# EAGLE design LiDAR_Demo_Board_Vert (EAGLE 9.2.2)
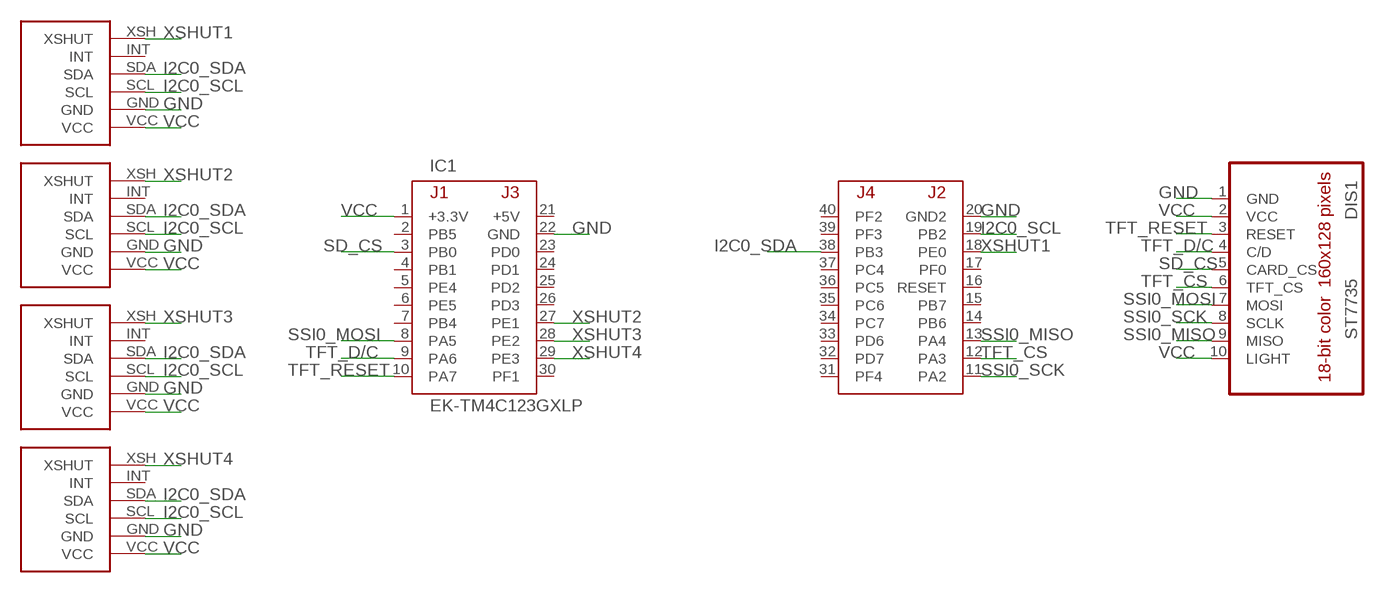
[diagram p0: schematic, sheet 1]

## Parts
DIS1  ST7735  [ST7735]
IC1  EK-TM4C123GXLP  [TM4C123LAUNCHPAD]
U$1  LIDAR_VL53L0X_ATK_VERT  [LIDAR_VL53L0X_ATK_VERT]
U$2  LIDAR_VL53L0X_ATK_VERT  [LIDAR_VL53L0X_ATK_VERT]
U$3  LIDAR_VL53L0X_ATK_VERT  [LIDAR_VL53L0X_ATK_VERT]
U$4  LIDAR_VL53L0X_ATK_VERT  [LIDAR_VL53L0X_ATK_VERT]

## Nets
GND: DIS1.1(GND) IC1.20(GND2) IC1.22(GND) U$1.GND U$2.GND U$3.GND U$4.GND
I2C0_SCL: IC1.19(PB2) U$1.SCL U$2.SCL U$3.SCL U$4.SCL
I2C0_SDA: IC1.38(PB3) U$1.SDA U$2.SDA U$3.SDA U$4.SDA
SD_CS: DIS1.5(CARD_CS) IC1.3(PB0)
SSI0_MISO: DIS1.9(MISO) IC1.13(PA4)
SSI0_MOSI: DIS1.7(MOSI) IC1.8(PA5)
SSI0_SCK: DIS1.8(SCLK) IC1.11(PA2)
TFT_CS: DIS1.6(TFT_CS) IC1.12(PA3)
TFT_D/C: DIS1.4(C/D) IC1.9(PA6)
TFT_RESET: DIS1.3(RESET) IC1.10(PA7)
VCC: DIS1.2(VCC) DIS1.10(LIGHT) IC1.1(+3.3V) U$1.VCC U$2.VCC U$3.VCC U$4.VCC
XSHUT1: IC1.18(PE0) U$1.XSH(XSHUT)
XSHUT2: IC1.27(PE1) U$2.XSH(XSHUT)
XSHUT3: IC1.28(PE2) U$3.XSH(XSHUT)
XSHUT4: IC1.29(PE3) U$4.XSH(XSHUT)
Unconnected: IC1.2(PB5) IC1.4(PB1) IC1.5(PE4) IC1.6(PE5) IC1.7(PB4) IC1.14(PB6) IC1.15(PB7) IC1.16(RESET) IC1.17(PF0) IC1.23(PD0) IC1.24(PD1) IC1.25(PD2) IC1.26(PD3) IC1.30(PF1) IC1.31(PF4) IC1.32(PD7) IC1.33(PD6) IC1.34(PC7) IC1.35(PC6) IC1.36(PC5) IC1.37(PC4) IC1.39(PF3) IC1.40(PF2) U$1.INT U$2.INT U$3.INT U$4.INT

## Power pins joined to a net without a drawn wire
+5V: IC1.21(+5V)

## Library data of the parts
DIS1 = UT_ECE:ST7735: Sitronix ST7735R 18-bit color, 1.8" TFT LCD display, 128*160, http://www.adafruit.com/products/358 // Backlight (pin 10) connected to +3.3 V // MISO (pin 9) PA4 (SSI0Rx) // SCK (pin 8) connected to PA2 (SSI0Clk) // MOSI (pin 7) connected to PA5 (SSI0Tx) // TFT_CS (pin 6) connected to PA3 (SSI0Fss) // CARD_CS (pin 5) connected to PD7 GPIO output(for SDC) // Data/Command (pin 4) connected to PA6 (GPIO), high for data, low for command // RESET (pin 3) connected to PA7 (GPIO) // VCC (pin 2) connected to +3.3 V // Gnd (pin 1) connected to ground; OC_FARNELL: unknown; OC_NEWARK: unknown
IC1 = UT_ECE:EK-TM4C123GXL: Texas Instruments TM4C123 LaunchPad EK-TM4C123GXL www.ti.com/tool/ek-tm4c123gxl
U$1-U$4 = Z:LIDAR_VL53L0X_ATK_VERT

## Board
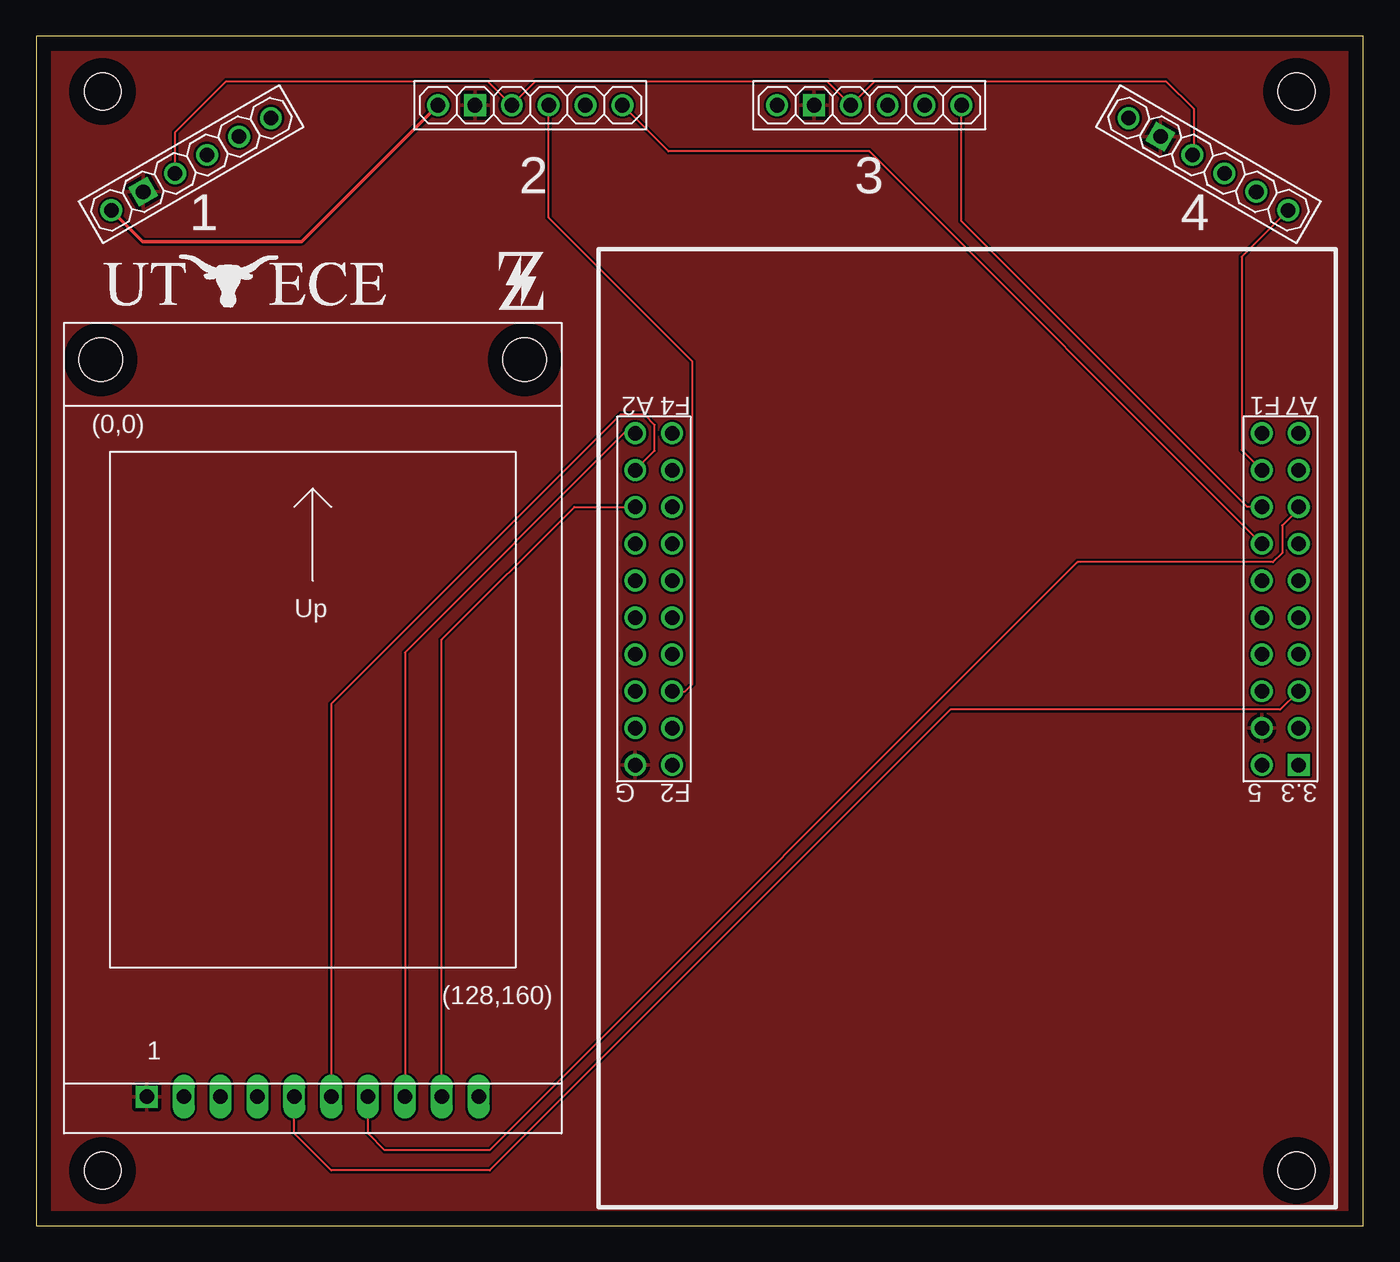
[diagram p1: board, top side]
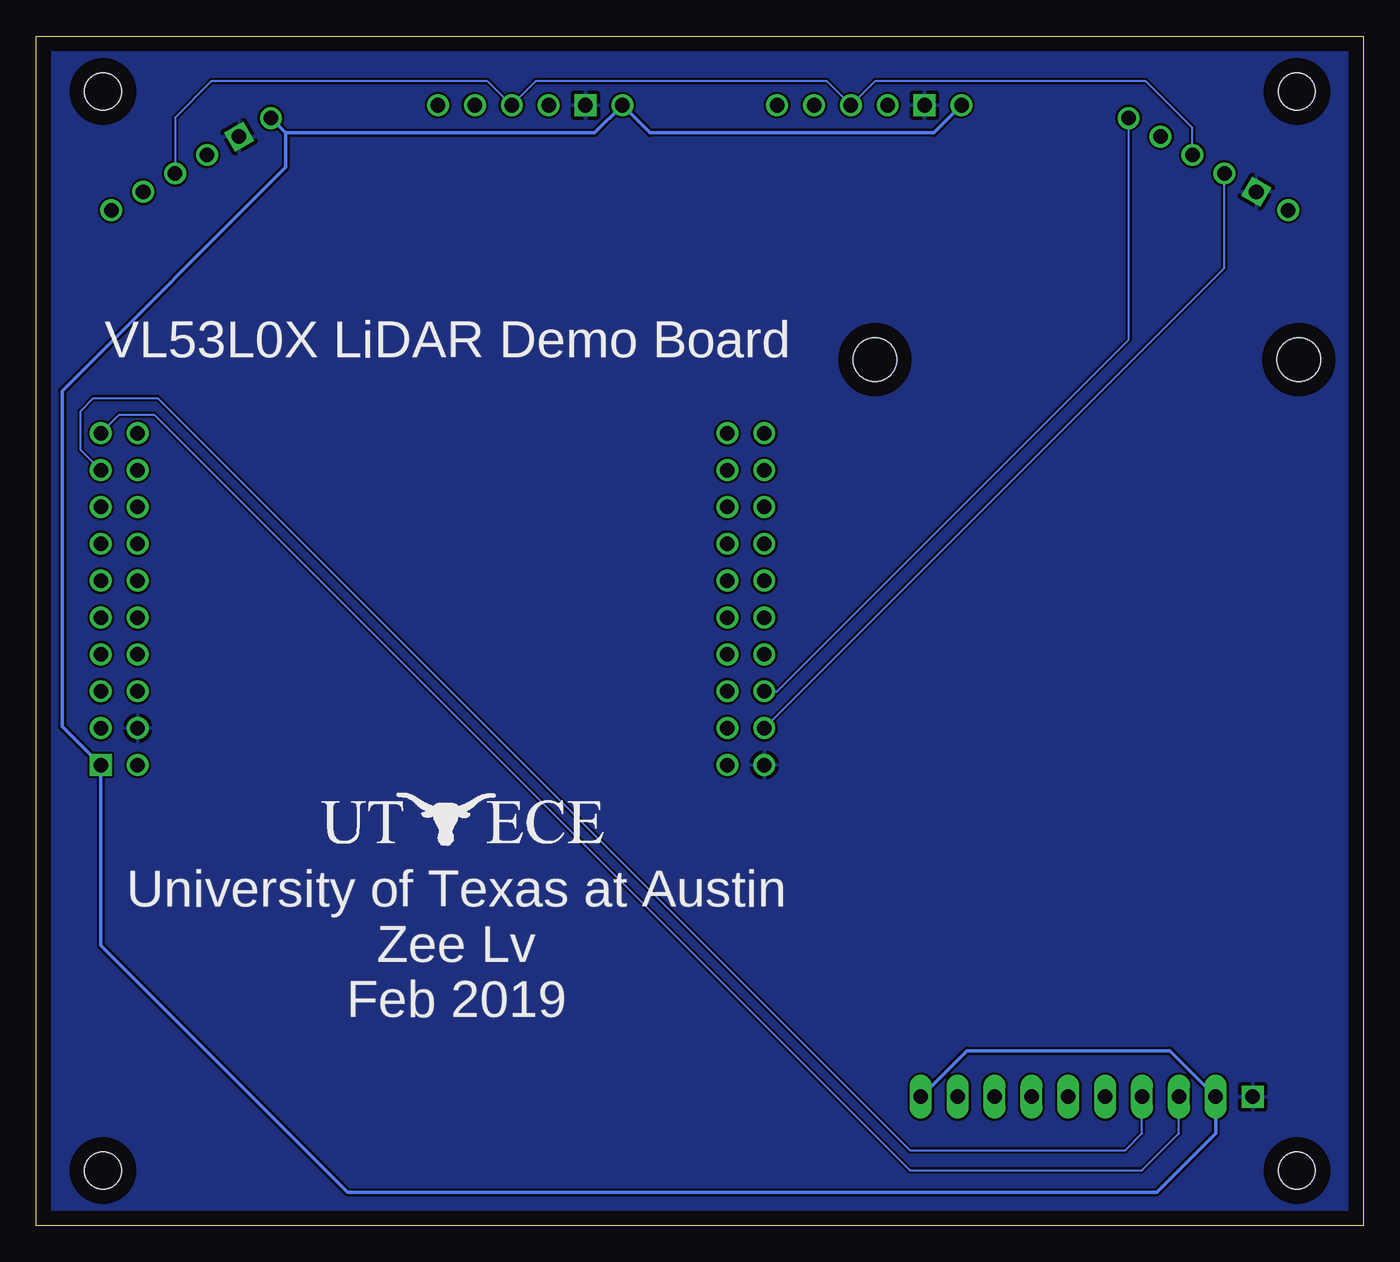
[diagram p2: board, bottom side, seen from below]

Size 91.44 x 81.97 mm. Coordinates in mm from the lower left corner, seen from the top.
Outline: 0,0 91.44,0 91.44,81.97 0,81.97 0,0
Copper layers (1*16): Top 0.035mm / dielectric 1.5mm / Bottom 0.035mm
Design rules "default": minimum track width 6mil, minimum drill 0.35mm, track to track 6mil, track to pad 6mil, pad to pad 6mil, via to via 6mil, smd to smd 6mil, copper to edge 40mil, drill to drill 6mil, minimum pad ring 10mil, minimum via ring 8mil, stop-mask expansion 4mil, vias tented up to drill 0mil, thermal gap 10mil
Holes 2.54 mm at 86.84,3.81 4.57,3.81 4.57,78.16 86.84,78.16

### Footprints (pad centres in the part's own frame; a part is rotated, then mirrored left to right if it is on the bottom)
ST7735 = drill 1 square: 1 -11.43,-30.48 | drill 1 long: 2 -8.89,-30.48; 3 -6.35,-30.48; 4 -3.81,-30.48; 5 -1.27,-30.48; 6 1.27,-30.48; 7 3.81,-30.48; 8 6.35,-30.48; 9 8.89,-30.48; 10 11.43,-30.48 | hole 3: -14.605,20.32; 14.605,20.32
TM4C123LAUNCHPAD = drill 1 square: 1 -22.86,12.7 | drill 1: 2 -22.86,10.16; 3 -22.86,7.62; 4 -22.86,5.08; 5 -22.86,2.54; 6 -22.86,0; 7 -22.86,-2.54; 8 -22.86,-5.08; 9 -22.86,-7.62; 10 -22.86,-10.16; 11 22.86,-10.16; 12 22.86,-7.62; 13 22.86,-5.08; 14 22.86,-2.54; 15 22.86,0; 16 22.86,2.54; 17 22.86,5.08; 18 22.86,7.62; 19 22.86,10.16; 20 22.86,12.7; 21 -20.32,12.7; 22 -20.32,10.16; 23 -20.32,7.62; 24 -20.32,5.08; 25 -20.32,2.54; 26 -20.32,0; 27 -20.32,-2.54; 28 -20.32,-5.08; 29 -20.32,-7.62; 30 -20.32,-10.16; 31 20.32,-10.16; 32 20.32,-7.62; 33 20.32,-5.08; 34 20.32,-2.54; 35 20.32,0; 36 20.32,2.54; 37 20.32,5.08; 38 20.32,7.62; 39 20.32,10.16; 40 20.32,12.7
LIDAR_VL53L0X_ATK_VERT = drill 1 square: GND -3.81,0 | drill 1: INT 3.81,0; SCL -1.27,0; SDA 1.27,0; VCC -6.35,0; XSH 6.35,0

### Placement (x,y rotation side)
DIS1  19.05,39.37 0 top
IC1  64.14,44.45 180 top
U$1  10.67,73.15 30 top
U$2  34.04,77.22 0 top
U$3  57.4,77.22 0 top
U$4  80.77,73.15 330 top
U$5  [LOGO_UT_ECE_20X4]  4.19,62.99 0 top
U$6  [LOGO_Z_3X4]  31.88,63.12 0 top
U$7  [LOGO_UT_ECE_20X4]  72.26,25.91 0 bottom

### Tracks (layer width: path | path; a pad name or v marks a point on that pad's centre or on a via)
GND
  pour Top: 0.13,81.66 0.13,0.13 91.31,0.13 91.31,81.66
  pour Bottom: 0.13,81.66 0.13,0.13 91.31,0.13 91.31,81.66
I2C0_SCL
  Top 0.152: U$1.SCL 9.57,75.35 13.08,78.87 31.11,78.87 U$2.SCL 34.42,78.87 54.48,78.87 U$3.SCL 57.78,78.87 77.85,78.87 79.76,76.96 79.76,73.87 U$4.SCL
  Bottom 0.152: IC1.19 9.57,66 U$1.SCL
I2C0_SDA
  Top 0.152: IC1.38 44.7,36.83 45.21,37.34 45.21,59.56 35.31,69.47 U$2.SDA
  Bottom 0.152: U$1.SDA 11.77,75.65 14.99,78.87 33.66,78.87 U$2.SDA 36.96,78.87 57.02,78.87 U$3.SDA 60.33,78.87 79.38,78.87 81.87,76.37 U$4.SDA | U$4.SDA
SD_CS
  Top 0.152: IC1.3 85.73,35.56 62.99,35.56 31.24,3.81 20.32,3.81 17.78,6.35 DIS1.5
SSI0_MISO
  Top 0.152: DIS1.9 27.94,40.39 37.08,49.53 IC1.13
SSI0_MOSI
  Top 0.152: IC1.8 86.99,49.4 85.85,48.26 85.85,46.35 85.22,45.72 71.76,45.72 31.24,5.21 24,5.21 22.86,6.35 DIS1.7
SSI0_SCK
  Top 0.152: IC1.11 40.51,54.61 25.4,39.5 DIS1.8
TFT_CS
  Top 0.152: IC1.12 42.61,53.4 42.61,55.18 41.91,55.88 40.26,55.88 20.32,35.94 DIS1.6
TFT_D/C
  Bottom 0.152: IC1.9 88.39,53.47 88.39,56.13 87.5,57.02 83.06,57.02 31.24,5.21 16.38,5.21 15.24,6.35 DIS1.4
TFT_RESET
  Bottom 0.152: IC1.10 85.73,55.88 83.31,55.88 31.24,3.81 15.24,3.81 12.7,6.35 DIS1.3
VCC
  Top 0.254: U$1.VCC 7.33,67.82 18.29,67.82 U$2.VCC
  Bottom 0.254: DIS1.10 27.31,12.06 13.34,12.06 DIS1.2 10.16,6.35 14.22,2.29 69.98,2.29 86.99,19.3 IC1.1 89.66,34.42 89.66,57.53 74.26,72.94 74.26,75.31 | U$2.VCC 29.59,75.31 49.15,75.31 U$3.VCC 52.96,75.31 74.26,75.31 | U$4.VCC 74.26,75.31 | 74.26,75.31
XSHUT1
  Bottom 0.152: IC1.18 40.39,36.83 16.17,61.05 U$1.XSH
XSHUT2
  Top 0.152: IC1.27 57.4,74.04 43.56,74.04 U$2.XSH
XSHUT3
  Top 0.152: IC1.28 83.44,49.53 63.75,69.22 U$3.XSH
XSHUT4
  Top 0.152: IC1.29 83.06,53.47 83.06,66.76 U$4.XSH

### Text on the board
tPlace: 2 | 3 | 1 | 4
bPlace: VL53L0X LiDAR Demo Board | University of Texas at Austin / Zee Lv / Feb 2019